# Altium project BlueberryPi-Core.PrjPcb
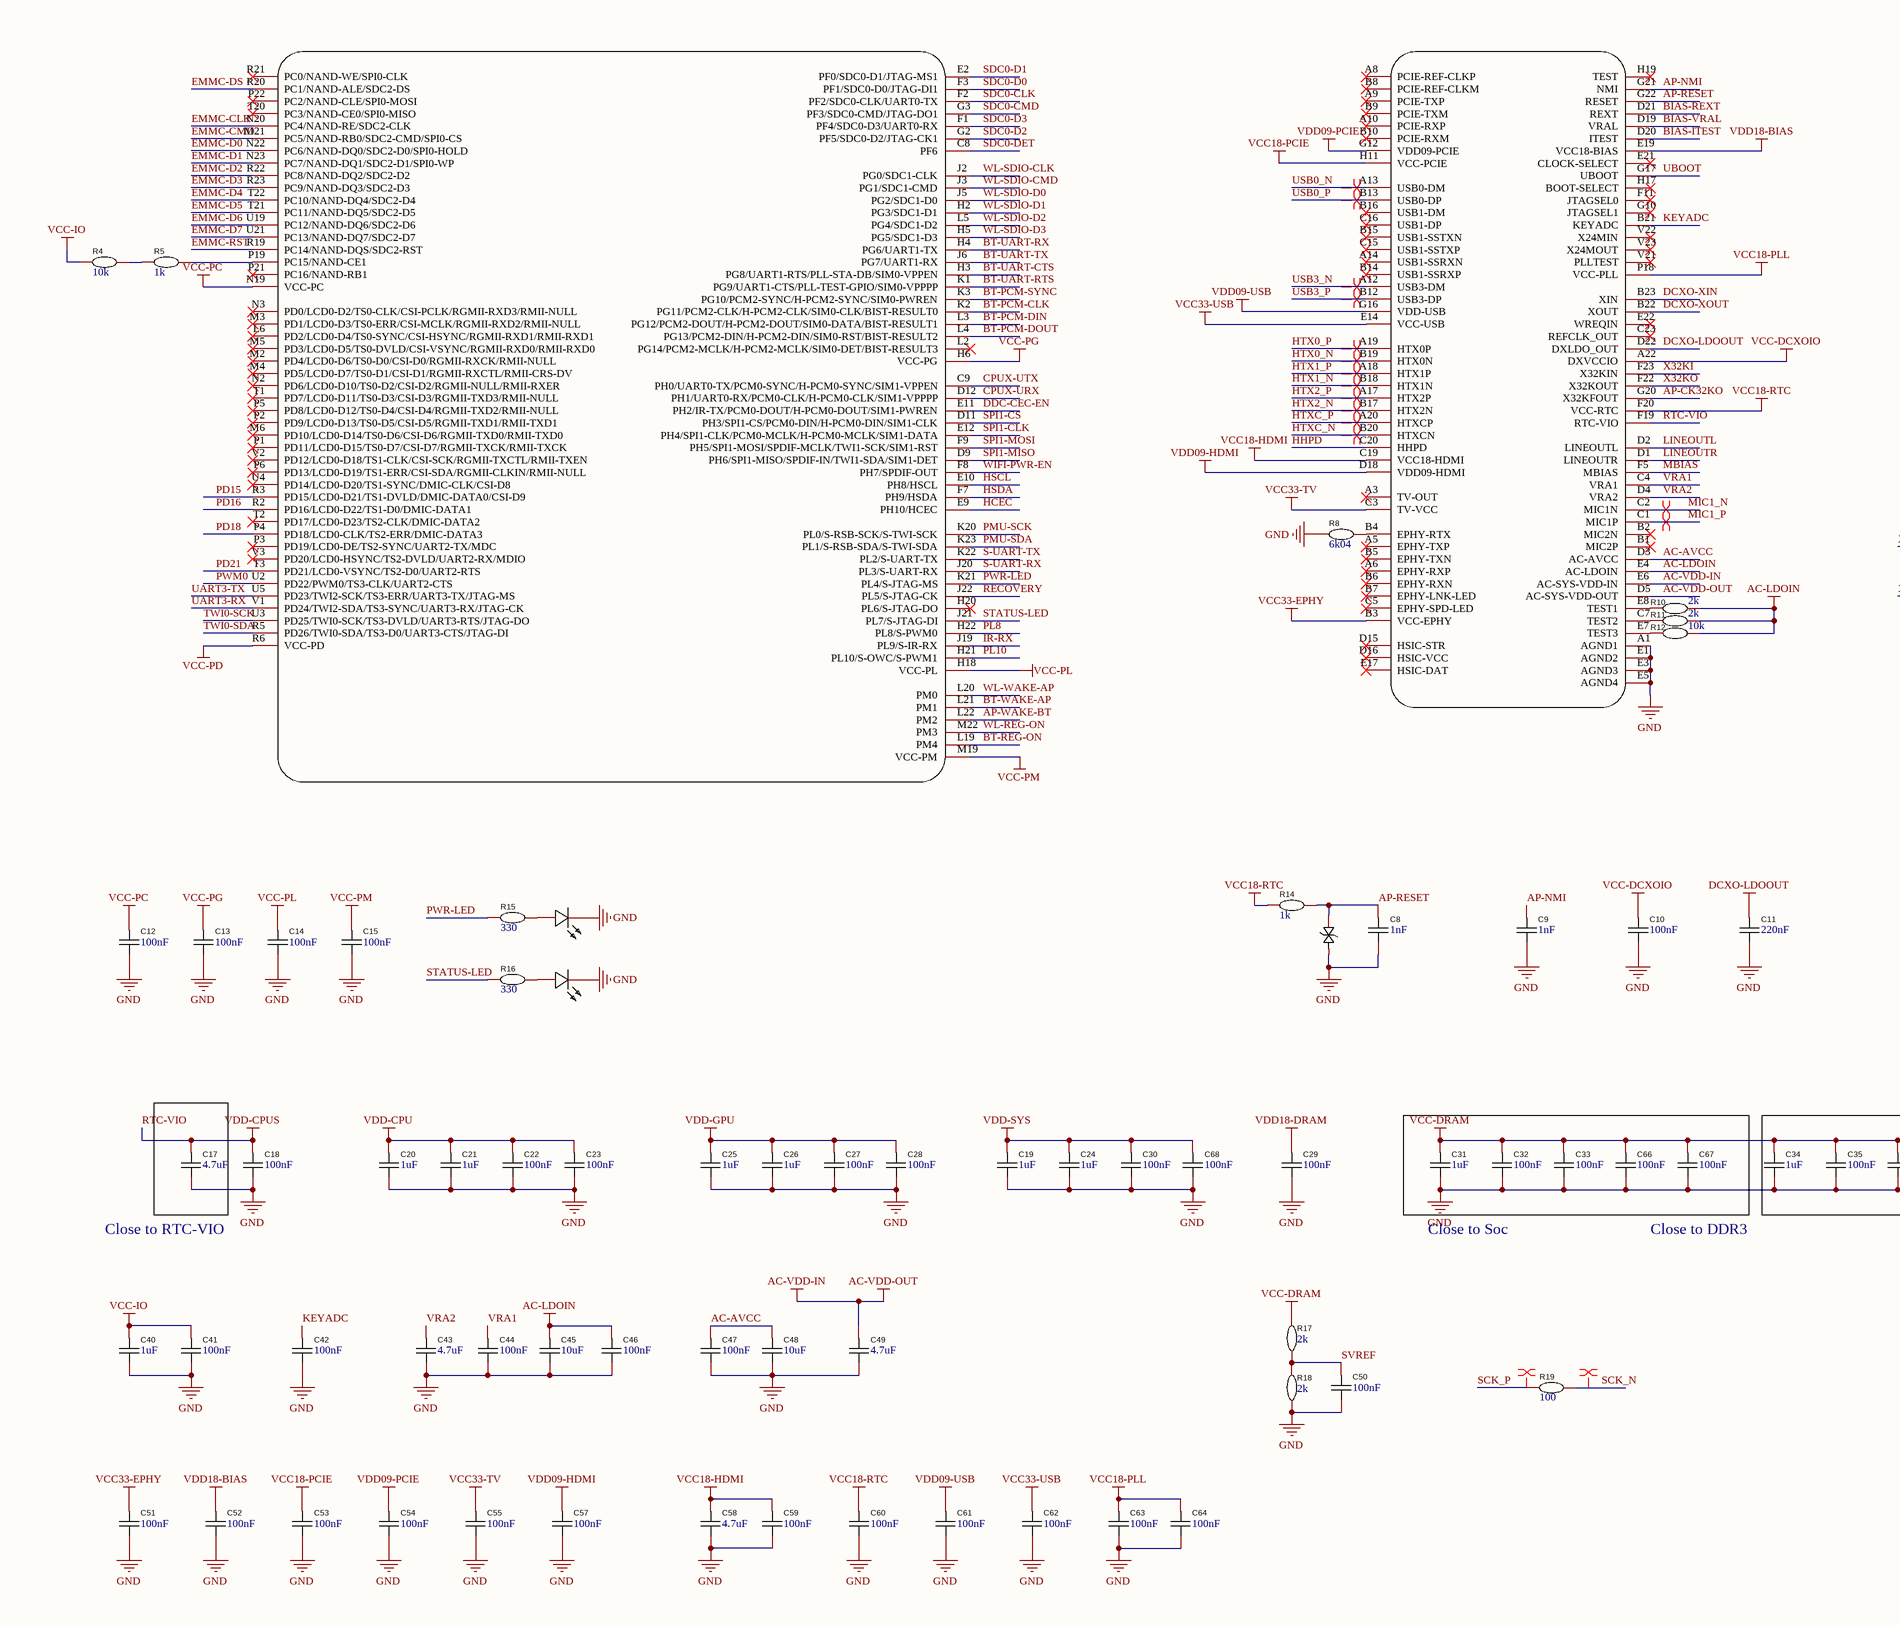
[diagram p0: Core.SchDoc, left]
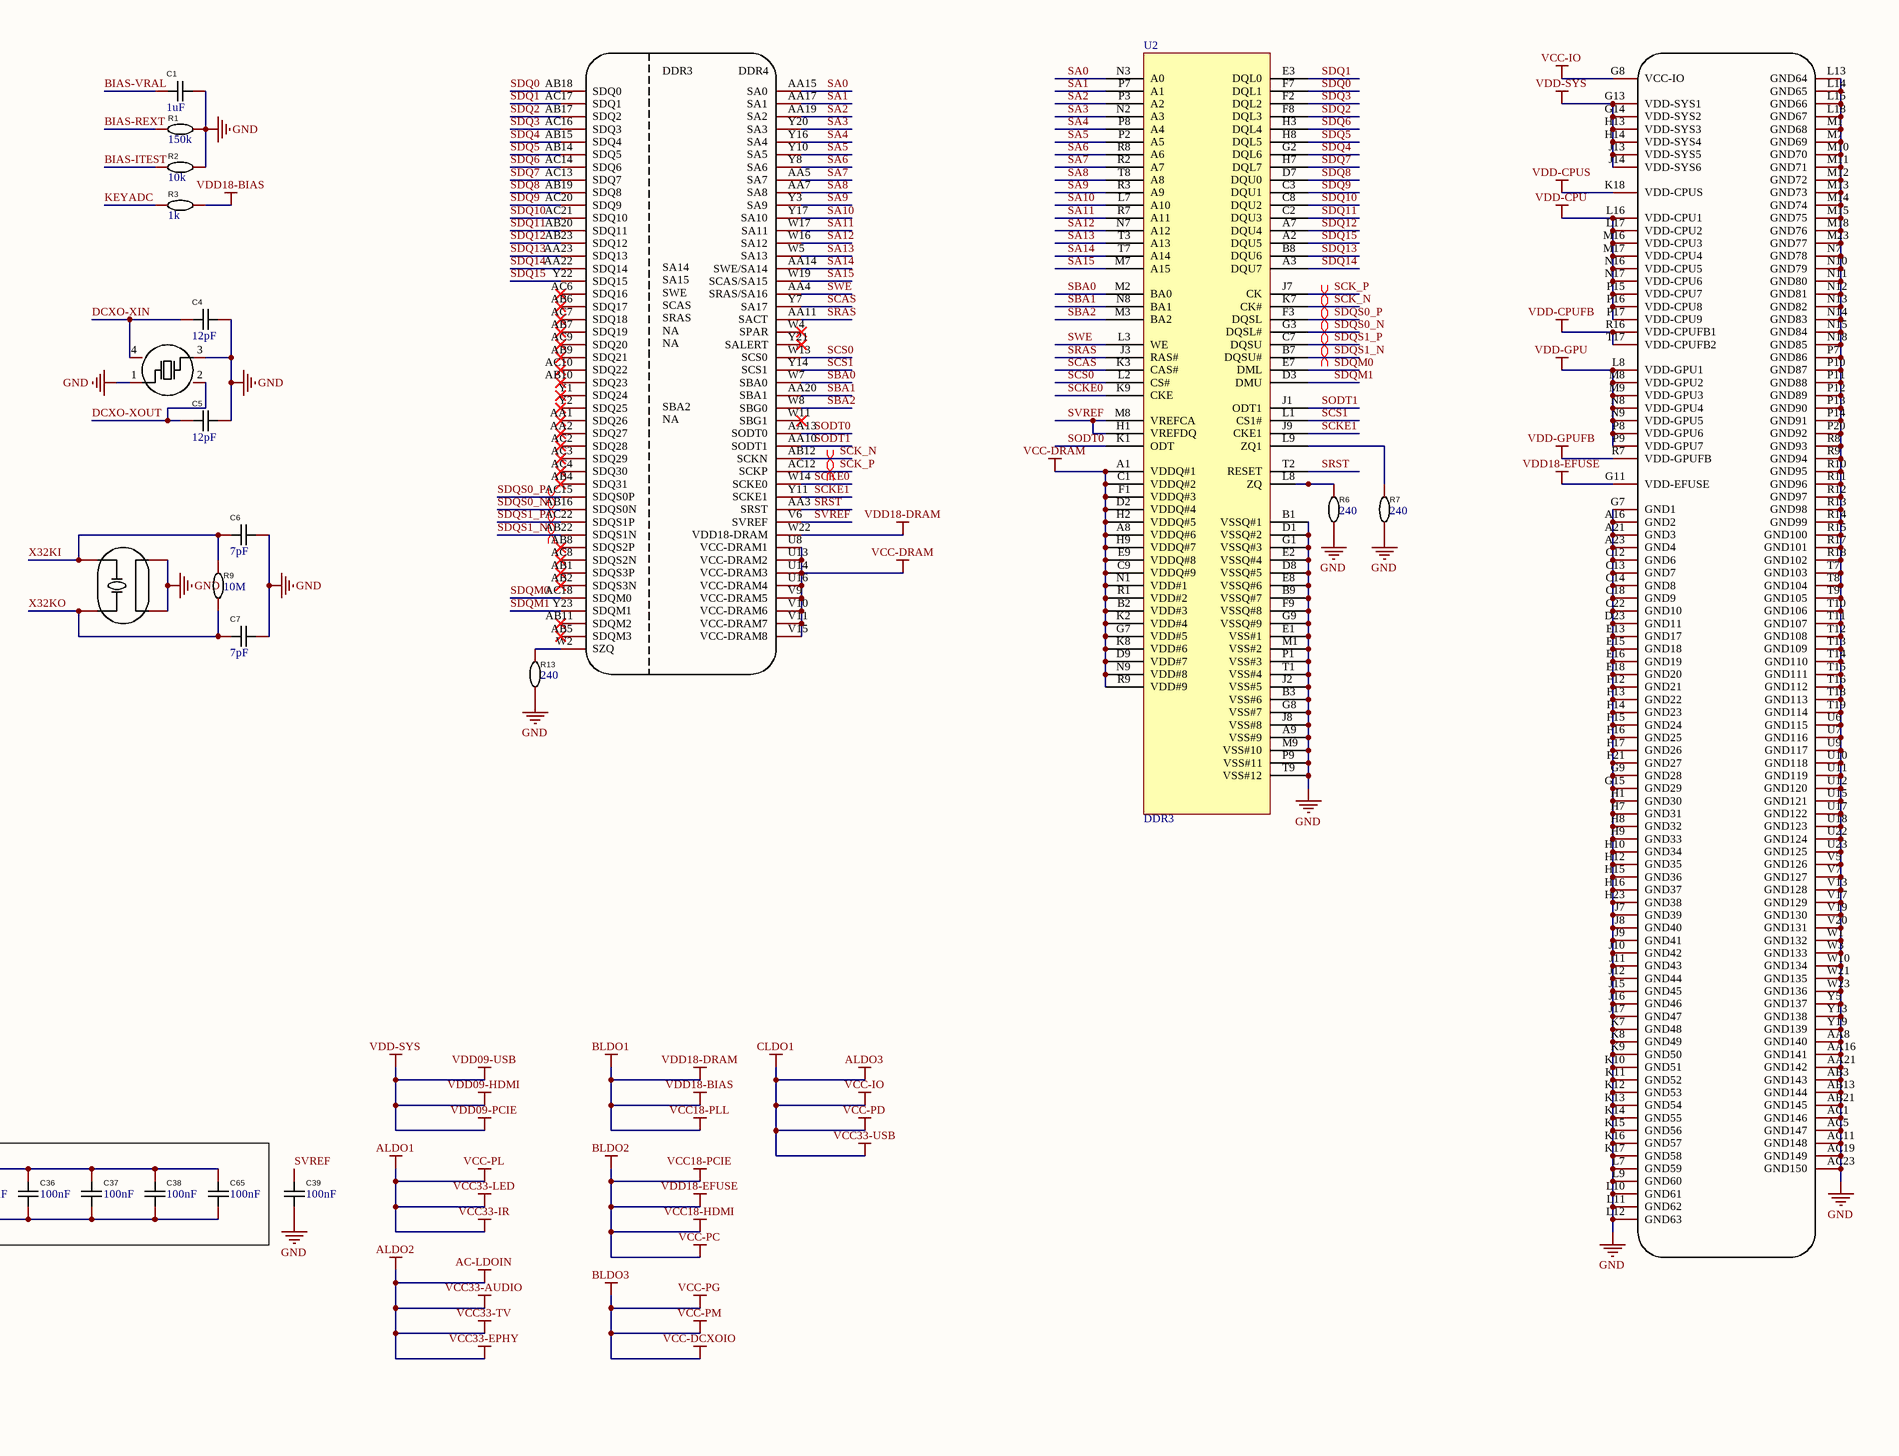
[diagram p1: Core.SchDoc, right]
1 sheet, 90 parts. Net scope: global (net labels, ports and power ports of the same name join across sheets).
Board file: BlueberryPiCore.PcbDoc

## Sheet Core.SchDoc
size A1; SheetNumber: 1; SheetTotal: 1

### Parts
C1  1uF  [C0402]
C4  12pF  [C0402]
C5  12pF  [C0402]
C6  7pF  [C0402]
C7  7pF  [C0402]
C8  1nF  [C0402]
C9  1nF  [C0402]
C10  100nF  [C0402]
C11  220nF  [C0402]
C12  100nF  [C0402]
C13  100nF  [C0402]
C14  100nF  [C0402]
C15  100nF  [C0402]
C17  4.7uF  [C0402]
C18  100nF  [C0402]
C19  1uF  [C0402]
C20  1uF  [C0402]
C21  1uF  [C0402]
C22  100nF  [C0402]
C23  100nF  [C0402]
C24  1uF  [C0402]
C25  1uF  [C0402]
C26  1uF  [C0402]
C27  100nF  [C0402]
C28  100nF  [C0402]
C29  100nF  [C0402]
C30  100nF  [C0402]
C31  1uF  [C0402]
C32  100nF  [C0402]
C33  100nF  [C0402]
C34  1uF  [C0402]
C35  100nF  [C0402]
C36  100nF  [C0402]
C37  100nF  [C0402]
C38  100nF  [C0402]
C39  100nF  [C0402]
C40  1uF  [C0402]
C41  100nF  [C0402]
C42  100nF  [C0402]
C43  4.7uF  [C0603]
C44  100nF  [C0402]
C45  10uF  [C0603]
C46  100nF  [C0402]
C47  100nF  [C0402]
C48  10uF  [C0603]
C49  4.7uF  [C0603]
C50  100nF  [C0402]
C51  100nF  [C0402]
C52  100nF  [C0402]
C53  100nF  [C0402]
C54  100nF  [C0402]
C55  100nF  [C0402]
C57  100nF  [C0402]
C58  4.7uF  [C0603]
C59  100nF  [C0402]
C60  100nF  [C0402]
C61  100nF  [C0402]
C62  100nF  [C0402]
C63  100nF  [C0402]
C64  100nF  [C0402]
C65  100nF  [C0402]
C66  100nF  [C0402]
C67  100nF  [C0402]
C68  100nF  [C0402]
LED1  LED  [LED0402-RD]  (value not drawn)
LED2  LED  [LED0402-RD]  (value not drawn)
R1  150k  [R0402]
R2  10k  [R0402]
R3  1k  [R0402]
R4  10k  [R0402]
R5  1k  [R0402]
R6  240  [R0402]
R7  240  [R0402]
R8  6k04  [R0402]
R9  10M  [R0402]
R10  2k  [R0402]
R11  2k  [R0402]
R12  10k  [R0402]
R13  240  [R0402]
R14  1k  [R0402]
R15  330  [R0402]
R16  330  [R0402]
R17  2k  [R0402]
R18  2k  [R0402]
R19  100  [R0402]
U1  Allwinner_H6  [BGA451_ALLWINNER_H6]  (value not drawn)  (parts A,B,C,D of 4)
U2  DDR3  [FBGA-96_L13.3-W7.5-R16-C6-P0.80-TL]
U3  ESD5451N  [DFN1006-2L_L1.0-W0.6-P0.70-BI]  (value not drawn)
X1  X322524MOB4SI  [CRYSTAL-SMD_4P-L3.2-W2.5-BL]  (value not drawn)
X2  MC-14632.768kHz7.0pF20PPM  [MC-146_4P-L6.7-W1.5-P0.85-TL]  (value not drawn)

### Nets
AC-LDOIN: C45.2 C46.2 C51.2 C55.2 R10.2 R11.2 R12.2 U1.B3(VCC-EPHY) U1.C3(TV-VCC) U1.E4(AC-LDOIN)  [also labelled ALDO2, VCC33-AUDIO, VCC33-EPHY, VCC33-TV]
AC-VDD-IN: C49.2 U1.D5(AC-SYS-VDD-OUT) U1.E6(AC-SYS-VDD-IN)  [also labelled AC-VDD-OUT]
ALDO1: C14.2 U1.H18(VCC-PL)  [also labelled VCC-PL, VCC33-IR, VCC33-LED]
ALDO3: C40.2 C41.2 C62.2 R4.1 U1.E14(VCC-USB) U1.G8(VCC-IO) U1.R6(VCC-PD)  [also labelled CLDO1, VCC-IO, VCC-PD, VCC33-USB]
BLDO1: C29.2 C52.2 C63.2 C64.2 R3.2 U1.E19(VCC18-BIAS) U1.P18(VCC-PLL) U1.W22(VDD18-DRAM)  [also labelled VCC18-PLL, VDD18-BIAS, VDD18-DRAM]
BLDO2: C12.2 C53.2 C58.2 C59.2 U1.C19(VCC18-HDMI) U1.G11(VDD-EFUSE) U1.H11(VCC-PCIE) U1.N19(VCC-PC)  [also labelled VCC-PC, VCC18-HDMI, VCC18-PCIE, VDD18-EFUSE]
BLDO3: C10.2 C13.2 C15.2 U1.A22(DXVCCIO) U1.H6(VCC-PG) U1.M19(VCC-PM)  [also labelled VCC-DCXOIO, VCC-PG, VCC-PM]
DCXO-LDOOUT: C11.2 U1.D22(DXLDO_OUT)
GND: C1.2 C4.2 C5.2 C6.2 C7.2 C8.1 C9.1 C10.1 C11.1 C12.1 C13.1 C14.1 C15.1 C17.1 C18.1 C19.1 C20.1 C21.1 C22.1 C23.1 C24.1 C25.1 C26.1 C27.1 C28.1 C29.1 C30.1 C31.1 C32.1 C33.1 C34.1 C35.1 C36.1 C37.1 C38.1 C39.1 C40.1 C41.1 C42.1 C43.1 C44.1 C45.1 C46.1 C47.1 C48.1 C49.1 C50.1 C51.1 C52.1 C53.1 C54.1 C55.1 C57.1 C58.1 C59.1 C60.1 C61.1 C62.1 C63.1 C64.1 C65.1 C66.1 C67.1 C68.1 LED1.1(K) LED2.1(K) R1.2 R2.2 R6.1 R7.1 R8.1 R13.1 R18.1 U1.A1(AGND1) U1.A16(GND2) U1.A21(GND3) U1.A23(GND4) U1.AA8(GND140) U1.AA16(GND141) U1.AA21(GND142) U1.AB3(GND143) U1.AB13(GND144) U1.AB21(GND145) U1.AC1(GND146) U1.AC5(GND147) U1.AC11(GND148) U1.AC19(GND149) U1.AC23(GND150) U1.C12(GND6) U1.C13(GND7) U1.C14(GND8) U1.C18(GND9) U1.C22(GND10) U1.D23(GND11) U1.E1(AGND2) U1.E3(AGND3) U1.E5(AGND4) U1.E13(GND17) U1.E15(GND18) U1.E16(GND19) U1.E18(GND20) U1.F12(GND21) U1.F13(GND22) U1.F14(GND23) U1.F15(GND24) U1.F16(GND25) U1.F17(GND26) U1.F21(GND27) U1.G7(GND1) U1.G9(GND28) U1.G15(GND29) U1.H1(GND30) U1.H7(GND31) U1.H8(GND32) U1.H9(GND33) U1.H10(GND34) U1.H12(GND35) U1.H15(GND36) U1.H16(GND37) U1.H23(GND38) U1.J7(GND39) U1.J8(GND40) U1.J9(GND41) U1.J10(GND42) U1.J11(GND43) U1.J12(GND44) U1.J15(GND45) U1.J16(GND46) U1.J17(GND47) U1.K7(GND48) U1.K8(GND49) U1.K9(GND50) U1.K10(GND51) U1.K11(GND52) U1.K12(GND53) U1.K13(GND54) U1.K14(GND55) U1.K15(GND56) U1.K16(GND57) U1.K17(GND58) U1.L7(GND59) U1.L9(GND60) U1.L10(GND61) U1.L11(GND62) U1.L12(GND63) U1.L13(GND64) U1.L14(GND65) U1.L15(GND66) U1.L18(GND67) U1.M1(GND68) U1.M7(GND69) U1.M10(GND70) U1.M11(GND71) U1.M12(GND72) U1.M13(GND73) U1.M14(GND74) U1.M15(GND75) U1.M18(GND76) U1.M23(GND77) U1.N7(GND78) U1.N10(GND79) U1.N11(GND80) U1.N12(GND81) U1.N13(GND82) U1.N14(GND83) U1.N15(GND84) U1.N18(GND85) U1.P7(GND86) U1.P10(GND87) U1.P11(GND88) U1.P12(GND89) U1.P13(GND90) U1.P14(GND91) U1.P20(GND92) U1.R8(GND93) U1.R9(GND94) U1.R10(GND95) U1.R11(GND96) U1.R12(GND97) U1.R13(GND98) U1.R14(GND99) U1.R15(GND100) U1.R17(GND101) U1.R18(GND102) U1.T7(GND103) U1.T8(GND104) U1.T9(GND105) U1.T10(GND106) U1.T11(GND107) U1.T12(GND108) U1.T13(GND109) U1.T14(GND110) U1.T15(GND111) U1.T16(GND112) U1.T18(GND113) U1.T19(GND114) U1.U6(GND115) U1.U7(GND116) U1.U9(GND117) U1.U10(GND118) U1.U11(GND119) U1.U12(GND120) U1.U15(GND121) U1.U17(GND122) U1.U18(GND123) U1.U22(GND124) U1.U23(GND125) U1.V5(GND126) U1.V7(GND127) U1.V13(GND128) U1.V17(GND129) U1.V19(GND130) U1.V20(GND131) U1.W1(GND132) U1.W3(GND133) U1.W10(GND134) U1.W21(GND135) U1.W23(GND136) U1.Y5(GND137) U1.Y13(GND138) U1.Y19(GND139) U2.A9(VSS#9) U2.B1(VSSQ#1) U2.B3(VSS#6) U2.B9(VSSQ#7) U2.D1(VSSQ#2) U2.D8(VSSQ#5) U2.E1(VSS#1) U2.E2(VSSQ#4) U2.E8(VSSQ#6) U2.F9(VSSQ#8) U2.G1(VSSQ#3) U2.G8(VSS#7) U2.G9(VSSQ#9) U2.J2(VSS#5) U2.J8(VSS#8) U2.M1(VSS#2) U2.M9(VSS#10) U2.P1(VSS#3) U2.P9(VSS#11) U2.T1(VSS#4) U2.T9(VSS#12) U3.1(K) X1.1(OSC1) X1.3(OSC2) X2.2 X2.3
RTC-VIO: C17.2 C18.2 U1.F19(RTC-VIO) U1.K18(VDD-CPUS)  [also labelled VDD-CPUS]
VCC18-RTC: C60.2 R14.1 U1.F20(VCC-RTC)
VCC-DRAM: C31.2 C32.2 C33.2 C34.2 C35.2 C36.2 C37.2 C38.2 C65.2 C66.2 C67.2 R17.2 U1.U8(VCC-DRAM1) U1.U13(VCC-DRAM2) U1.U14(VCC-DRAM3) U1.U16(VCC-DRAM4) U1.V9(VCC-DRAM5) U1.V10(VCC-DRAM6) U1.V11(VCC-DRAM7) U1.V15(VCC-DRAM8) U2.A1(VDDQ#1) U2.A8(VDDQ#6) U2.B2(VDD#3) U2.C1(VDDQ#2) U2.C9(VDDQ#9) U2.D2(VDDQ#4) U2.D9(VDD#7) U2.E9(VDDQ#8) U2.F1(VDDQ#3) U2.G7(VDD#5) U2.H2(VDDQ#5) U2.H9(VDDQ#7) U2.K2(VDD#4) U2.K8(VDD#6) U2.N1(VDD#1) U2.N9(VDD#8) U2.R1(VDD#2) U2.R9(VDD#9)
VDD-CPU: C20.2 C21.2 C22.2 C23.2 U1.L16(VDD-CPU1) U1.L17(VDD-CPU2) U1.M16(VDD-CPU3) U1.M17(VDD-CPU4) U1.N16(VDD-CPU5) U1.N17(VDD-CPU6) U1.P15(VDD-CPU7) U1.P16(VDD-CPU8) U1.P17(VDD-CPU9)
VDD-CPUFB: U1.R16(VDD-CPUFB1) U1.T17(VDD-CPUFB2)
VDD-GPU: C25.2 C26.2 C27.2 C28.2 U1.L8(VDD-GPU1) U1.M8(VDD-GPU2) U1.M9(VDD-GPU3) U1.N8(VDD-GPU4) U1.N9(VDD-GPU5) U1.P8(VDD-GPU6) U1.P9(VDD-GPU7)
VDD-GPUFB: U1.R7(VDD-GPUFB)
VDD-SYS: C19.2 C24.2 C30.2 C54.2 C57.2 C61.2 C68.2 U1.D18(VDD09-HDMI) U1.G12(VDD09-PCIE) U1.G13(VDD-SYS1) U1.G14(VDD-SYS2) U1.G16(VDD-USB) U1.H13(VDD-SYS3) U1.H14(VDD-SYS4) U1.J13(VDD-SYS5) U1.J14(VDD-SYS6)  [also labelled VDD09-HDMI, VDD09-PCIE, VDD09-USB]
AC-AVCC: C47.2 C48.2 U1.D3(AC-AVCC)
AP-CK32KO: U1.G20(X32KFOUT)
AP-NMI: C9.2 U1.G21(NMI)
AP-RESET: C8.2 R14.2 U1.G22(RESET) U3.2(A)
AP-WAKE-BT: U1.L22(PM2)
BIAS-ITEST: R2.1 U1.D20(ITEST)
BIAS-REXT: R1.1 U1.D21(REXT)
BIAS-VRAL: C1.1 U1.D19(VRAL)
BT-PCM-CLK: U1.K2(PG11/PCM2-CLK/H-PCM2-CLK/SIM0-CLK/BIST-RESULT0)
BT-PCM-DIN: U1.L3(PG12/PCM2-DOUT/H-PCM2-DOUT/SIM0-DATA/BIST-RESULT1)
BT-PCM-DOUT: U1.L4(PG13/PCM2-DIN/H-PCM2-DIN/SIM0-RST/BIST-RESULT2)
BT-PCM-SYNC: U1.K3(PG10/PCM2-SYNC/H-PCM2-SYNC/SIM0-PWREN)
BT-REG-ON: U1.L19(PM4)
BT-UART-CTS: U1.H3(PG8/UART1-RTS/PLL-STA-DB/SIM0-VPPEN)
BT-UART-RTS: U1.K1(PG9/UART1-CTS/PLL-TEST-GPIO/SIM0-VPPPP)
BT-UART-RX: U1.H4(PG6/UART1-TX)
BT-UART-TX: U1.J6(PG7/UART1-RX)
BT-WAKE-AP: U1.L21(PM1)
CPUX-URX: U1.D12(PH1/UART0-RX/PCM0-CLK/H-PCM0-CLK/SIM1-VPPPP)
CPUX-UTX: U1.C9(PH0/UART0-TX/PCM0-SYNC/H-PCM0-SYNC/SIM1-VPPEN)
DCXO-XIN: C4.1 U1.B23(XIN) X1.4(GND)
DCXO-XOUT: C5.1 U1.B22(XOUT) X1.2(GND)
DDC-CEC-EN: U1.E11(PH2/IR-TX/PCM0-DOUT/H-PCM0-DOUT/SIM1-PWREN)
EMMC-CLK: U1.N20(PC4/NAND-RE/SDC2-CLK)
EMMC-CMD: U1.M21(PC5/NAND-RB0/SDC2-CMD/SPI0-CS)
EMMC-D0: U1.N22(PC6/NAND-DQ0/SDC2-D0/SPI0-HOLD)
EMMC-D1: U1.N23(PC7/NAND-DQ1/SDC2-D1/SPI0-WP)
EMMC-D2: U1.R22(PC8/NAND-DQ2/SDC2-D2)
EMMC-D3: U1.R23(PC9/NAND-DQ3/SDC2-D3)
EMMC-D4: U1.T22(PC10/NAND-DQ4/SDC2-D4)
EMMC-D5: U1.T21(PC11/NAND-DQ5/SDC2-D5)
EMMC-D6: U1.U19(PC12/NAND-DQ6/SDC2-D6)
EMMC-D7: U1.U21(PC13/NAND-DQ7/SDC2-D7)
EMMC-DS: U1.R20(PC1/NAND-ALE/SDC2-DS)
EMMC-RST: U1.R19(PC14/NAND-DQS/SDC2-RST)
HCEC: U1.E9(PH10/HCEC)
HHPD: U1.C20(HHPD)
HSCL: U1.E10(PH8/HSCL)
HSDA: U1.F7(PH9/HSDA)
HTX0_N: U1.B19(HTX0N)
HTX0_P: U1.A19(HTX0P)
HTX1_N: U1.B18(HTX1N)
HTX1_P: U1.A18(HTX1P)
HTX2_N: U1.B17(HTX2N)
HTX2_P: U1.A17(HTX2P)
HTXC_N: U1.B20(HTXCN)
HTXC_P: U1.A20(HTXCP)
IR-RX: U1.J19(PL9/S-IR-RX)
KEYADC: C42.2 R3.1 U1.B21(KEYADC)
LINEOUTL: U1.D2(LINEOUTL)
LINEOUTR: U1.D1(LINEOUTR)
MBIAS: U1.F5(MBIAS)
MIC1_N: U1.C2(MIC1N)
MIC1_P: U1.C1(MIC1P)
PD15: U1.R3(PD15/LCD0-D21/TS1-DVLD/DMIC-DATA0/CSI-D9)
PD16: U1.R2(PD16/LCD0-D22/TS1-D0/DMIC-DATA1)
PD18: U1.P4(PD18/LCD0-CLK/TS2-ERR/DMIC-DATA3)
PD21: U1.T3(PD21/LCD0-VSYNC/TS2-D0/UART2-RTS)
PL8: U1.H22(PL8/S-PWM0)
PL10: U1.H21(PL10/S-OWC/S-PWM1)
PMU-SCK: U1.K20(PL0/S-RSB-SCK/S-TWI-SCK)
PMU-SDA: U1.K23(PL1/S-RSB-SDA/S-TWI-SDA)
PWM0: U1.U2(PD22/PWM0/TS3-CLK/UART2-CTS)
PWR-LED: R15.1 U1.K21(PL4/S-JTAG-MS)
RECOVERY: U1.J22(PL5/S-JTAG-CK)
S-UART-RX: U1.J20(PL3/S-UART-RX)
S-UART-TX: U1.K22(PL2/S-UART-TX)
SA0: U1.AA15(SA0) U2.N3(A0)
SA1: U1.AA17(SA1) U2.P7(A1)
SA2: U1.AA19(SA2) U2.P3(A2)
SA3: U1.Y20(SA3) U2.N2(A3)
SA4: U1.Y16(SA4) U2.P8(A4)
SA5: U1.Y10(SA5) U2.P2(A5)
SA6: U1.Y8(SA6) U2.R8(A6)
SA7: U1.AA5(SA7) U2.R2(A7)
SA8: U1.AA7(SA8) U2.T8(A8)
SA9: U1.Y3(SA9) U2.R3(A9)
SA10: U1.Y17(SA10) U2.L7(A10)
SA11: U1.W17(SA11) U2.R7(A11)
SA12: U1.W16(SA12) U2.N7(A12)
SA13: U1.W5(SA13) U2.T3(A13)
SA14: U1.AA14(SWE/SA14) U2.T7(A14)
SA15: U1.W19(SCAS/SA15) U2.M7(A15)
SBA0: U1.W7(SBA0) U2.M2(BA0)
SBA1: U1.AA20(SBA1) U2.N8(BA1)
SBA2: U1.W8(SBG0) U2.M3(BA2)
SCAS: U1.Y7(SA17) U2.K3(CAS#)
SCK_N: R19.2 U1.AB12(SCKN) U2.K7(CK#)
SCK_P: R19.1 U1.AC12(SCKP) U2.J7(CK)
SCKE0: U1.W14(SCKE0) U2.K9(CKE)
SCKE1: U1.Y11(SCKE1) U2.J9(CKE1)
SCS0: U1.W13(SCS0) U2.L2(CS#)
SCS1: U1.Y14(SCS1) U2.L1(CS1#)
SDC0-CLK: U1.F2(PF2/SDC0-CLK/UART0-TX)
SDC0-CMD: U1.G3(PF3/SDC0-CMD/JTAG-DO1)
SDC0-D0: U1.F3(PF1/SDC0-D0/JTAG-DI1)
SDC0-D1: U1.E2(PF0/SDC0-D1/JTAG-MS1)
SDC0-D2: U1.G2(PF5/SDC0-D2/JTAG-CK1)
SDC0-D3: U1.F1(PF4/SDC0-D3/UART0-RX)
SDC0-DET: U1.C8(PF6)
SDQ0: U1.AB18(SDQ0) U2.F7(DQL1)
SDQ1: U1.AC17(SDQ1) U2.E3(DQL0)
SDQ2: U1.AB17(SDQ2) U2.F8(DQL3)
SDQ3: U1.AC16(SDQ3) U2.F2(DQL2)
SDQ4: U1.AB15(SDQ4) U2.G2(DQL6)
SDQ5: U1.AB14(SDQ5) U2.H8(DQL5)
SDQ6: U1.AC14(SDQ6) U2.H3(DQL4)
SDQ7: U1.AC13(SDQ7) U2.H7(DQL7)
SDQ8: U1.AB19(SDQ8) U2.D7(DQU0)
SDQ9: U1.AC20(SDQ9) U2.C3(DQU1)
SDQ10: U1.AC21(SDQ10) U2.C8(DQU2)
SDQ11: U1.AB20(SDQ11) U2.C2(DQU3)
SDQ12: U1.AB23(SDQ12) U2.A7(DQU4)
SDQ13: U1.AA23(SDQ13) U2.B8(DQU6)
SDQ14: U1.AA22(SDQ14) U2.A3(DQU7)
SDQ15: U1.Y22(SDQ15) U2.A2(DQU5)
SDQM0: U1.AC18(SDQM0) U2.E7(DML)
SDQM1: U1.Y23(SDQM1) U2.D3(DMU)
SDQS0_N: U1.AB16(SDQS0N) U2.G3(DQSL#)
SDQS0_P: U1.AC15(SDQS0P) U2.F3(DQSL)
SDQS1_N: U1.AB22(SDQS1N) U2.B7(DQSU#)
SDQS1_P: U1.AC22(SDQS1P) U2.C7(DQSU)
SODT0: U1.AA13(SODT0) U2.K1(ODT)
SODT1: U1.AA10(SODT1) U2.J1(ODT1)
SPI1-CLK: U1.E12(PH4/SPI1-CLK/PCM0-MCLK/H-PCM0-MCLK/SIM1-DATA)
SPI1-CS: U1.D11(PH3/SPI1-CS/PCM0-DIN/H-PCM0-DIN/SIM1-CLK)
SPI1-MISO: U1.D9(PH6/SPI1-MISO/SPDIF-IN/TWI1-SDA/SIM1-DET)
SPI1-MOSI: U1.F9(PH5/SPI1-MOSI/SPDIF-MCLK/TWI1-SCK/SIM1-RST)
SRAS: U1.AA11(SACT) U2.J3(RAS#)
SRST: U1.AA3(SRST) U2.T2(RESET)
STATUS-LED: R16.1 U1.J21(PL7/S-JTAG-DI)
SVREF: C39.2 C50.2 R17.1 R18.2 U1.V6(SVREF) U2.H1(VREFDQ) U2.M8(VREFCA)
SWE: U1.AA4(SRAS/SA16) U2.L3(WE)
TWI0-SCK: U1.U3(PD25/TWI0-SCK/TS3-DVLD/UART3-RTS/JTAG-DO)
TWI0-SDA: U1.R5(PD26/TWI0-SDA/TS3-D0/UART3-CTS/JTAG-DI)
UART3-RX: U1.V1(PD24/TWI2-SDA/TS3-SYNC/UART3-RX/JTAG-CK)
UART3-TX: U1.U5(PD23/TWI2-SCK/TS3-ERR/UART3-TX/JTAG-MS)
UBOOT: U1.G17(UBOOT)
USB0_N: U1.A13(USB0-DM)
USB0_P: U1.B13(USB0-DP)
USB3_N: U1.A12(USB3-DM)
USB3_P: U1.B12(USB3-DP)
VRA1: C44.2 U1.C4(VRA1)
VRA2: C43.2 U1.D4(VRA2)
WIFI-PWR-EN: U1.F8(PH7/SPDIF-OUT)
WL-REG-ON: U1.M22(PM3)
WL-SDIO-CLK: U1.J2(PG0/SDC1-CLK)
WL-SDIO-CMD: U1.J3(PG1/SDC1-CMD)
WL-SDIO-D0: U1.J5(PG2/SDC1-D0)
WL-SDIO-D1: U1.H2(PG3/SDC1-D1)
WL-SDIO-D2: U1.L5(PG4/SDC1-D2)
WL-SDIO-D3: U1.H5(PG5/SDC1-D3)
WL-WAKE-AP: U1.L20(PM0)
X32KI: C6.1 R9.2 U1.F23(X32KIN) X2.4(OSC2)
X32KO: C7.1 R9.1 U1.F22(X32KOUT) X2.1(OSC1)
NetLED1_2: LED1.2(A) R15.2
NetLED2_2: LED2.2(A) R16.2
NetR4_2: R4.2 R5.1
NetR5_2: R5.2 U1.P19(PC15/NAND-CE1)
NetR6_2: R6.2 U2.L8(ZQ)
NetR7_2: R7.2 U2.L9(ZQ1)
NetR8_2: R8.2 U1.B4(EPHY-RTX)
NetR10_1: R10.1 U1.E8(TEST1)
NetR11_1: R11.1 U1.C7(TEST2)
NetR12_1: R12.1 U1.E7(TEST3)
NetR13_2: R13.2 U1.W2(SZQ)

Not connected (* = marked no-connect by the designer): U1 A3(TV-OUT)* A5(EPHY-TXP)* A6(EPHY-RXP)* A8(PCIE-REF-CLKP)* A9(PCIE-TXP)* A10(PCIE-RXP)* A14(USB1-SSRXN)* AA1(SDQ26)* AA2(SDQ27)* AB1(SDQS3P)* AB2(SDQS3N)* AB4(SDQ31)* AB5(SDQM3)* AB6(SDQ17)* AB7(SDQ19)* AB8(SDQS2P)* AB9(SDQ21)* AB10(SDQ23)* AB11(SDQM2)* AC2(SDQ28)* AC3(SDQ29)* AC4(SDQ30)* AC6(SDQ16)* AC7(SDQ18)* AC8(SDQS2N)* AC9(SDQ20)* AC10(SDQ22)* B1(MIC2P)* B2(MIC2N)* B5(EPHY-TXN)* B6(EPHY-RXN)* B7(EPHY-LNK-LED)* B8(PCIE-REF-CLKM)* B9(PCIE-TXM)* B10(PCIE-RXM)* B14(USB1-SSRXP)* B15(USB1-SSTXN)* B16(USB1-DM)* C5(EPHY-SPD-LED)* C15(USB1-SSTXP)* C16(USB1-DP)* C23(REFCLK_OUT)* D15(HSIC-STR)* D16(HSIC-VCC)* E17(HSIC-DAT)* E21(CLOCK-SELECT)* E22(WREQIN)* F11(JTAGSEL0)* G10(JTAGSEL1)* H17(BOOT-SELECT)* H19(TEST)* H20(PL6/S-JTAG-DO)* L2(PG14/PCM2-MCLK/H-PCM2-MCLK/SIM0-DET/BIST-RESULT3)* L6(PD2/LCD0-D4/TS0-SYNC/CSI-HSYNC/RGMII-RXD1/RMII-RXD1)* M2(PD4/LCD0-D6/TS0-D0/CSI-D0/RGMII-RXCK/RMII-NULL)* M3(PD1/LCD0-D3/TS0-ERR/CSI-MCLK/RGMII-RXD2/RMII-NULL)* M4(PD5/LCD0-D7/TS0-D1/CSI-D1/RGMII-RXCTL/RMII-CRS-DV)* M5(PD3/LCD0-D5/TS0-DVLD/CSI-VSYNC/RGMII-RXD0/RMII-RXD0)* M6(PD10/LCD0-D14/TS0-D6/CSI-D6/RGMII-TXD0/RMII-TXD0)* N2(PD6/LCD0-D10/TS0-D2/CSI-D2/RGMII-NULL/RMII-RXER)* N3(PD0/LCD0-D2/TS0-CLK/CSI-PCLK/RGMII-RXD3/RMII-NULL)* P1(PD11/LCD0-D15/TS0-D7/CSI-D7/RGMII-TXCK/RMII-TXCK)* P2(PD9/LCD0-D13/TS0-D5/CSI-D5/RGMII-TXD1/RMII-TXD1)* P3(PD19/LCD0-DE/TS2-SYNC/UART2-TX/MDC)* P5(PD8/LCD0-D12/TS0-D4/CSI-D4/RGMII-TXD2/RMII-NULL)* P6(PD13/LCD0-D19/TS1-ERR/CSI-SDA/RGMII-CLKIN/RMII-NULL)* P21(PC16/NAND-RB1)* P22(PC2/NAND-CLE/SPI0-MOSI)* R21(PC0/NAND-WE/SPI0-CLK)* T1(PD7/LCD0-D11/TS0-D3/CSI-D3/RGMII-TXD3/RMII-NULL)* T2(PD17/LCD0-D23/TS2-CLK/DMIC-DATA2)* T20(PC3/NAND-CE0/SPI0-MISO)* U4(PD14/LCD0-D20/TS1-SYNC/DMIC-CLK/CSI-D8)* V2(PD12/LCD0-D18/TS1-CLK/CSI-SCK/RGMII-TXCTL/RMII-TXEN)* V3(PD20/LCD0-HSYNC/TS2-DVLD/UART2-RX/MDIO)* V21(PLLTEST)* V22(X24MIN)* V23(X24MOUT)* W4(SPAR)* W11(SBG1)* Y1(SDQ24)* Y2(SDQ25)* Y21(SALERT)*

### Layout directives
differential pair: HTX0_N, HTX0_P, HTX1_N, HTX1_P, HTX2_N, HTX2_P, HTXC_N, HTXC_P, MIC1_N, MIC1_P, SCK_N, SCK_P, SDQS0_N, SDQS0_P, SDQS1_N, SDQS1_P, USB0_N, USB0_P, USB3_N, USB3_P

### Notes on the sheet
- Close to RTC-VIO
- Close to Soc
- Close to DDR3
- (in symbol Allwinner_H6, part A) DDR3; DDR4; SA14; SA15; SWE; SCAS; SRAS; NA; SBA2

### Library data of the parts
C1 C4-C9 C11 C17 C19-C21 C24-C26 C31 C34 C40 = 电容-0402: Manufacturer: muRata(村田); Name: 100nF; Symbol: GRM155R71H104KE14D; Add into BOM: yes; Tolerance: ±10%; Voltage Rated: 50V; Temperature Coefficient: X7R; Value: 100nF; Device: GRM155R71H104KE14D; LCSC Part Name: 100nF ±10% 50V; Supplier Part: C77020; Manufacturer Part: GRM155R71H104KE14D; Supplier Footprint: 0402; JLCPCB Part Class: Extended Part; Datasheet: https://atta.szlcsc.com/upload/public/pdf/source/20180326/C77020_39BD49C951FF1AF0DB1F1FAC5AC1E401.pdf; Supplier: LCSC; Convert to PCB: yes; Capacitance: 100nF
C10 C12-C15 C18 C22 C23 C27-C30 C32 C33 C35-C39 C41 C42 C44 C46 C47 C50-C55 C57 C59-C68 = 电容-0402: Manufacturer: muRata(村田); Symbol: GRM155R71H104KE14D; Add into BOM: yes; Tolerance: ±10%; Voltage Rated: 50V; Temperature Coefficient: X7R; Name: 100nF; Device: GRM155R71H104KE14D; LCSC Part Name: 100nF ±10% 50V; Supplier Part: C77020; Manufacturer Part: GRM155R71H104KE14D; Supplier Footprint: 0402; JLCPCB Part Class: Extended Part; Datasheet: https://atta.szlcsc.com/upload/public/pdf/source/20180326/C77020_39BD49C951FF1AF0DB1F1FAC5AC1E401.pdf; Supplier: LCSC; Convert to PCB: yes; Capacitance: 100nF; Value: 100nF
C43 C45 C48 C49 C58 = 电容-0603: Manufacturer: YAGEO(国巨); Name: 100nF; Symbol: CC0603KRX7R9BB104; Add into BOM: yes; Tolerance: ±10%; Voltage Rated: 50V; Temperature Coefficient: X7R; Value: 100nF; Device: CC0603KRX7R9BB104; LCSC Part Name: 100nF ±10% 50V; Supplier Part: C14663; Manufacturer Part: CC0603KRX7R9BB104; Supplier Footprint: 0603; JLCPCB Part Class: Basic Part; Datasheet: https://atta.szlcsc.com/upload/public/pdf/source/20180910/C282072_33301C7F631E79921B82A8DAC6BCC5B3.pdf; Supplier: LCSC; Convert to PCB: yes
LED1 LED2 = NCD0402R1: Manufacturer: 国星光电; Symbol: FC-F1005HRK-620H5; Add into BOM: yes; Emitted Color: 红灯; Name: NCD0402R1; Device: NCD0402R1; LCSC Part Name: NCD0402R1; Supplier Part: C130719; Manufacturer Part: NCD0402R1; Supplier Footprint: 0402; JLCPCB Part Class: Extended Part; Datasheet: https://atta.szlcsc.com/upload/public/pdf/source/20200820/C130719_A72EA5A7FEC83C35856EA0453E4EE775.pdf; Supplier: LCSC; Convert to PCB: yes
R1-R19 = 电阻-0402: Manufacturer: UNI-ROYAL(厚声); Name: 1kΩ; Symbol: 0402WGF1001TCE; Add into BOM: yes; Tolerance: ±1%; Power(Watts): 62.5mW; Temperature Coefficient: ±100ppm/℃; Overload Voltage (Max): 50V; Value: 1kΩ; Device: 0402WGF1001TCE; LCSC Part Name: 1kΩ ±1% 62.5mW; Supplier Part: C11702; Manufacturer Part: 0402WGF1001TCE; Supplier Footprint: 0402; JLCPCB Part Class: Basic Part; Datasheet: https://atta.szlcsc.com/upload/public/pdf/source/20200306/C422600_1E6D84923E4A46A82E41ADD87F860B5C.pdf; Supplier: LCSC; Convert to PCB: yes; Type: 厚膜电阻; Operating Temperature Range: -55℃~+155℃
U1 = Allwinner_H6: 全志H6; Add into BOM: yes; Symbol: Allwinner_H6; Device: Allwinner_H6; Convert to PCB: yes
U2 = Component_1
U3 = ESD5451N: Manufacturer: TECH PUBLIC(台舟); Symbol: ESD5451N-; Convert to PCB: yes; Device: ESD5451N; Add into BOM: yes; Supplier: LCSC; Datasheet: https://atta.szlcsc.com/upload/public/pdf/source/20211227/D040CF3F0222548C5BD9F7E690946783.pdf; Supplier Part: C2936977; JLCPCB Part Class: 扩展库
X1 = X322524MOB4SI: 晶振类型:贴片无源晶振;频率:24MHz;频率公差:±10ppm;频率稳定度:±30ppm;负载电容:12pF;工作温度:-40℃~+85℃;; Manufacturer: YXC(扬兴晶振); Name: 24MHz; Add into BOM: yes; Crystal Type: 贴片无源晶振; Value: 24MHz; Frequency Tolerance: ±10ppm; Frequency Stability: ±30ppm; Load Capacitance: 12pF; Symbol: X322524MOB4SI; Device: X322524MOB4SI; LCSC Part Name: 24MHz ±10ppm 12pF; Supplier Part: C70590; Manufacturer Part: X322524MOB4SI; Supplier Footprint: SMD3225-4P; JLCPCB Part Class: 扩展库; Datasheet: https://atta.szlcsc.com/upload/public/pdf/source/20210329/C112971_1F611BDC486E193C1706F6D8EB5AA189.pdf; Supplier: LCSC; Convert to PCB: yes; Operating Temperature: -40℃~+85℃
X2 = MC-14632.768kHz7.0pF20PPM: 晶振类型:贴片无源晶振;频率:32.768kHz;频率公差:±20ppm;负载电容:7pF;等效串联电阻(ESR):65kΩ;工作温度:-40℃~+85℃;; Manufacturer: EPSON(爱普生); Add into BOM: yes; Crystal Type: 贴片无源晶振; Frequency Tolerance: ±20ppm; Load Capacitance: 7pF; Equivalent Series Resistance (ESR): 65kΩ; Name: 32.768kHz; Symbol: MC-14632.768kHz7.0pF20PPM; Device: MC-14632.768kHz7.0pF20PPM; LCSC Part Name: 32.768kHz ±20ppm 7pF; Supplier Part: C94977; Manufacturer Part: MC-14632.768kHz7.0pF20PPM; Supplier Footprint: MC-146; JLCPCB Part Class: 扩展库; Datasheet: https://atta.szlcsc.com/upload/public/pdf/source/20170211/1486785670215.pdf; Supplier: LCSC; Convert to PCB: yes; Value: 32.768kHz; Operating Temperature: -40℃~+85℃